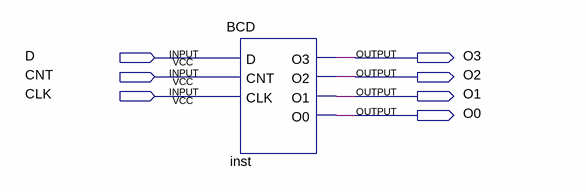
[diagram p0: schematic sheet]
// Quartus schematic BCBCounter.bdf as structural Verilog: 1 symbols, 7 pins
module BCBCounter (
  input  D,
  input  CNT,
  input  CLK,
  output O3,
  output O2,
  output O1,
  output O0
);

  BCD inst (.D(D), .CNT(CNT), .CLK(CLK), .O3(O3), .O2(O2), .O1(O1), .O0(O0));
endmodule
